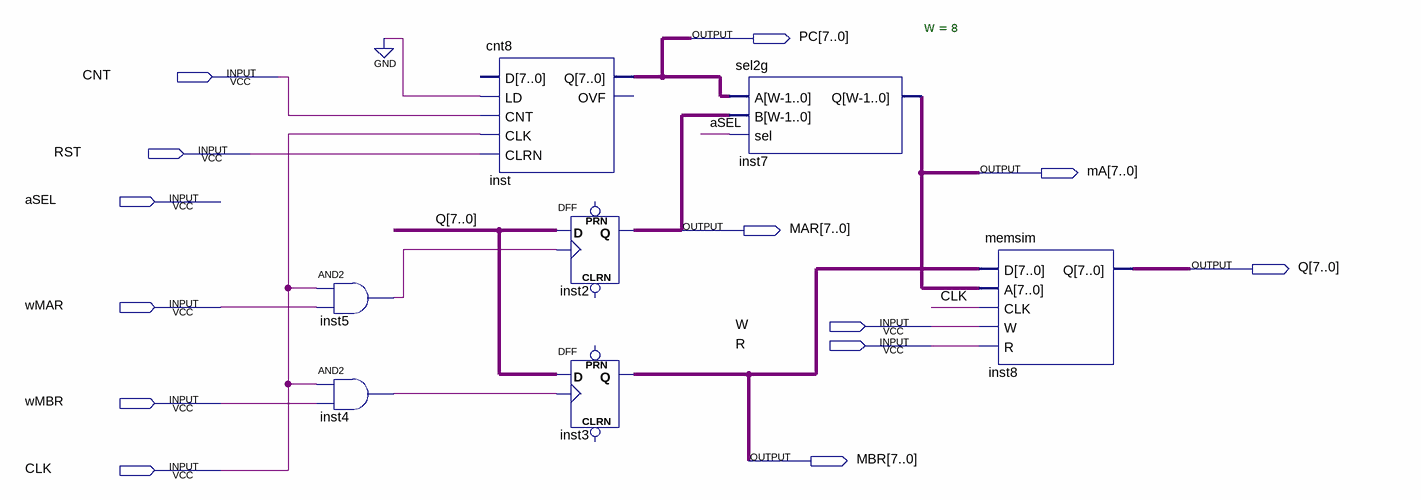
[diagram p0: schematic sheet]
// Quartus schematic memtest.bdf as structural Verilog: 7 symbols, 13 pins
module memtest (
  input  CNT,
  input  RST,
  input  aSEL,
  input  wMAR,
  input  W,
  input  R,
  input  wMBR,
  input  CLK,
  output [7:0] PC,
  output [7:0] mA,
  output [7:0] MAR,
  output [7:0] Q,
  output [7:0] MBR
);

  wire inst4_out, inst5_out;

  and inst5 (inst5_out, CLK, wMAR);
  and inst4 (inst4_out, CLK, wMBR);
  cnt8 inst (.LD(1'b0), .CNT(CNT), .CLK(CLK), .CLRN(RST), .Q(PC));  // open: D, OVF
  DFF inst2[7:0] (.CLK(inst5_out), .D(Q), .Q(MAR));  // open: CLRN, PRN
  DFF inst3[7:0] (.CLK(inst4_out), .D(Q), .Q(MBR));  // open: CLRN, PRN
  sel2g #(.W(8)) inst7 (.A(PC), .B(MAR), .sel(aSEL), .Q(mA));
  memsim inst8 (.D(MBR), .A(mA), .CLK(CLK), .W(W), .R(R), .Q(Q));
endmodule
